# Altium project doppler.PrjPcb (part 1 of 2)
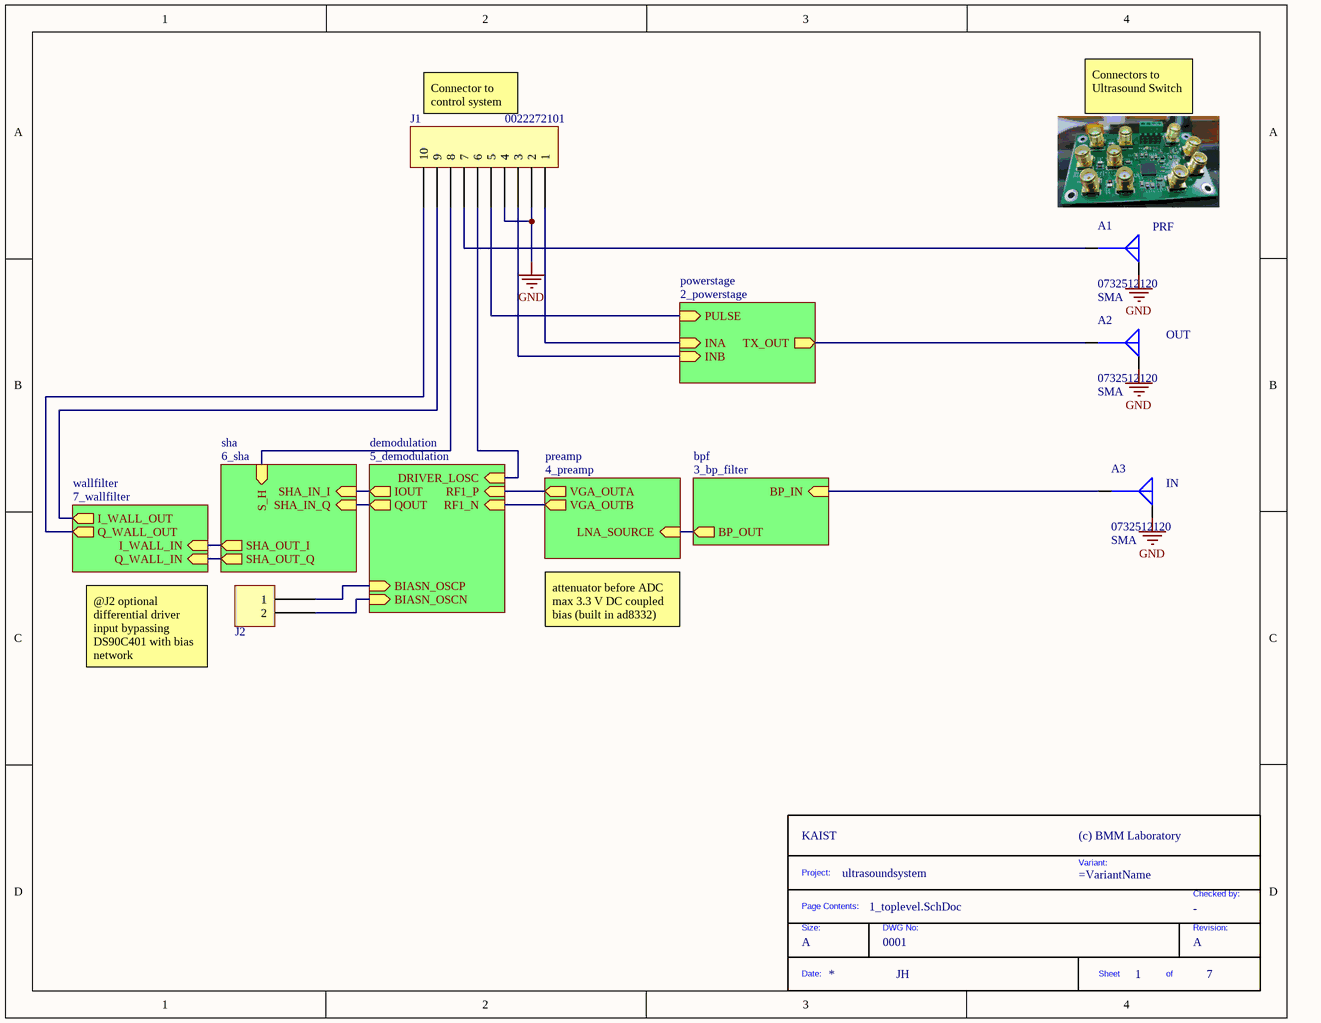
[diagram p0: 1_toplevel.SchDoc]
CAGE_CODE: ?????; COMPANY: KAIST; CONTRACT_NUMBER: <CONTRACT NO>; DesignedByURL: JH; DOC_NO_ASSY_DWG: <ASSY DWG NO>; DOC_NO_BOM: <BOM DOC NO>; DOC_NO_FAB_DWG: <FAB DWG NO>; DOC_NO_SCH_DWG: <SCH DWG NO>; MOTD: (c) BMM Laboratory; PCB_2_DEC_TOL: +/-.01; PCB_3_DEC_TOL: +/-.010; PCB_ANG_TOL: +/-1/2; PCB_ASSEMBLY_NO: <PCB ASSY NO>; PCB_CHECKER: - -----; PCB_CHECKER_APP_DATE: --/--/----; PCB_DESIGNER: JH; PCB_DESIGNER_APP_DATE: --/--/----; PCB_DWG_NO: <PCB DWG NO>; PCB_ENGINEER: JH; PCB_ENGINEER_APP_DATE: --/--/----; PCB_PART_NUMBER: <PCB PN>; PCB_REV: A; PROJECT: ultrasoundsystem; SCH_REV: A; VersionRevision: A
7 sheets, 117 parts. Net scope: hierarchical (ports join the sheet entries above them; power ports are global).
Board file: doppler.PcbDoc
Sheets:
  1_toplevel.SchDoc
    powerstage = 2_powerstage.SchDoc
    preamp = 4_preamp.SchDoc
    demodulation = 5_demodulation.SchDoc
    wallfilter = 7_wallfilter.SchDoc
    bpf = 3_bp_filter.SchDoc
    sha = 6_sha.SchDoc

## Sheet 1_toplevel.SchDoc
size A; SheetNumber: 1; SheetTotal: 7

### Parts
(Parts that share a designator on the sheet are numbered #1, #2 ... from top to bottom, then left to right.)
*?#1  DWG No: 0001  Size: A  (hidden comment: TitleBlock)  (graphical)
A1  0732512120  Connector Style: SMA  [MOLEX SD-73251-212]
A2  0732512120  Connector Style: SMA  [MOLEX SD-73251-212]
A3  0732512120  Connector Style: SMA  [MOLEX SD-73251-212]
J1  0022272101  [MOLEX KK 0022272101]
J2  0022272021  [MOLEX KK 0022272021]  (value not drawn)

### Sub-sheets
bpf = 3_bp_filter: BP_IN (in), BP_OUT (out)
demodulation = 5_demodulation: RF1_P (in), RF1_N (in), IOUT (out), QOUT (out), BIASN_OSCP (in), BIASN_OSCN (in), DRIVER_LOSC (in)
powerstage = 2_powerstage: INA (in), INB (in), TX_OUT (out), PULSE (in)
preamp = 4_preamp: LNA_SOURCE (in), VGA_OUTA (out), VGA_OUTB (out)
sha = 6_sha: SHA_IN_I (in), SHA_IN_Q (in), S_H (in), SHA_OUT_I (out), SHA_OUT_Q (out)
wallfilter = 7_wallfilter: I_WALL_IN (in), Q_WALL_IN (in), I_WALL_OUT (out), Q_WALL_OUT (out)

### Nets
GND: A1.G A2.G A3.G J1.2 J1.4
S_H: J1.8 ; sheet sha/S_H
NetA1_S: A1.S J1.7
NetA2_S: A2.S ; sheet powerstage/TX_OUT
NetA3_S: A3.S ; sheet bpf/BP_IN
NetC29_2: J2.1 ; sheet demodulation/BIASN_OSCP
NetC30_2: J2.2 ; sheet demodulation/BIASN_OSCN
NetC31_2: J1.6 ; sheet demodulation/DRIVER_LOSC
NetC35_1: sheet wallfilter/I_WALL_IN, sheet sha/SHA_OUT_I
NetC37_1: sheet wallfilter/Q_WALL_IN, sheet sha/SHA_OUT_Q
NetJ1_1: J1.1 ; sheet powerstage/INA
NetJ1_3: J1.3 ; sheet powerstage/INB
NetJ1_5: J1.5 ; sheet powerstage/PULSE
NetJ1_9: J1.9 ; sheet wallfilter/I_WALL_OUT
NetJ1_10: J1.10 ; sheet wallfilter/Q_WALL_OUT
NetR3_2: sheet preamp/VGA_OUTA, sheet demodulation/RF1_P
NetR4_2: sheet preamp/VGA_OUTB, sheet demodulation/RF1_N
NetU3_3: sheet preamp/LNA_SOURCE, sheet bpf/BP_OUT
NetU5_6: sheet demodulation/IOUT, sheet sha/SHA_IN_I
NetU6_6: sheet demodulation/QOUT, sheet sha/SHA_IN_Q

### Notes on the sheet
- Connector to control system
- Connectors to Ultrasound Switch
- (near A1) PRF
- (near A2) OUT
- (near A3) IN
- attenuator before ADC
  max 3.3 V DC coupled bias (built in ad8332)
- @J2 optional differential driver input bypassing DS90C401 with bias network
- (in symbol TitleBlock) Project:; Variant:; Checked by:; Page Contents:; Size:; DWG No:; Revision:; Date:; Sheet; of

### Library data of the parts
*?#1 = TitleBlock: Standard Title Block; Checked by: -
A1-A3 = 0732512120: CONN SMA JACK STR 50OHM EDGE MNT; Manufacturer: Molex; Connector Type: Jack, Female Socket; Contact Termination: Solder; Frequency - Max: 18GHz; Number of Ports: 1; Part Number: 0732512120; ComponentLink1Description: Datasheet; ComponentLink1URL: https://www.molex.com/pdm_docs/sd/732512120_sd.pdf; ComponentLink2Description: DigiKey Link; ComponentLink2URL: http://digikey.com/product-detail/en/molex/0732512120/WM5536-ND/1465158; Fastening Type: Threaded; Housing Color: Gold; Impedance: 50Ohm; LastUpdated: 2022-06-29 18:09:19; Lifecycle Status: Active; Minimum Order: 1; Mounting Feature: Bulkhead - Front Side Nut; Mounting Type: Board Edge, End Launch; Panel Mount; Packaging: Bag; Part Status: Active; Price: 3.64; Series: 73251; Shield Termination: Solder; Supplier 1: DigiKey; Supplier Part Number 1: WM5536-ND
J1 = 0022272101: CONN HEADER VERT 10POS 2.54MM; Manufacturer: Molex; Contact Length - Mating: 0.295" (7.49mm); Contact Length - Post: 0.140" (3.56mm); Material Flammability Rating: UL94 V-0; Number of Positions: 10; Number of Positions Loaded: All; Overall Contact Length: 0.560" (14.22mm); Pitch - Mating: 0.100" (2.54mm); Shrouding: Shrouded - 1 Wall; Style: Board to Cable/Wire; Part Number: 0022272101; ComponentLink1Description: Datasheet; ComponentLink1URL: https://www.molex.com/pdm_docs/sd/022272101_sd.pdf; ComponentLink2Description: DigiKey Link; ComponentLink2URL: http://digikey.com/product-detail/en/molex/0022272101/WM4119-ND/1130585; Connector Type: Header; Contact Finish - Mating: Tin; Contact Finish - Post: Tin; Contact Finish Thickness - Mating: 100.0µin (2.54µm); Contact Material: Brass; Contact Shape: Square; Contact Type: Male Pin; Fastening Type: Friction Lock; Insulation Color: Natural; Insulation Height: 0.461" (11.70mm); Insulation Material: Polyamide (PA), Nylon; LastUpdated: 2020-01-12 23:53:02; Lifecycle Status: Active; Minimum Order: 1; Mounting Type: Through Hole; Number of Rows: 1; Packaging: Bulk; PartId: 84; Part Status: Active; Price: 0.73; Series: KK 6410; Supplier 1: DigiKey; Supplier Part Number 1: WM4119-ND; Termination: Solder
J2 = 0022272021: CONN HEADER VERT 2POS 2.54MM; Manufacturer: Molex; Contact Length - Mating: 0.295" (7.49mm); Contact Length - Post: 0.140" (3.56mm); Material Flammability Rating: UL94 V-0; Number of Positions: 2; Number of Positions Loaded: All; Overall Contact Length: 0.560" (14.22mm); Pitch - Mating: 0.100" (2.54mm); Shrouding: Shrouded - 1 Wall; Style: Board to Cable/Wire; Part Number: 0022272021; ComponentLink1Description: Datasheet; ComponentLink1URL: https://www.molex.com/pdm_docs/sd/022272021_sd.pdf; ComponentLink2Description: DigiKey Link; ComponentLink2URL: http://digikey.com/product-detail/en/molex/0022272021/WM4111-ND/1130577; Connector Type: Header; Contact Finish - Mating: Tin; Contact Finish - Post: Tin; Contact Finish Thickness - Mating: 100.0µin (2.54µm); Contact Material: Brass; Contact Shape: Square; Contact Type: Male Pin; Fastening Type: Friction Lock; Insulation Color: Natural; Insulation Height: 0.461" (11.70mm); Insulation Material: Polyamide (PA), Nylon; LastUpdated: 2020-01-12 23:51:43; Lifecycle Status: Active; Minimum Order: 1; Mounting Type: Through Hole; Number of Rows: 1; Packaging: Bulk; PartId: 76; Part Status: Active; Price: 0.27; Series: KK 6410; Supplier 1: DigiKey; Supplier Part Number 1: WM4111-ND; Termination: Solder

## Sheet 2_powerstage.SchDoc
size A; SheetNumber: 2; SheetTotal: 7
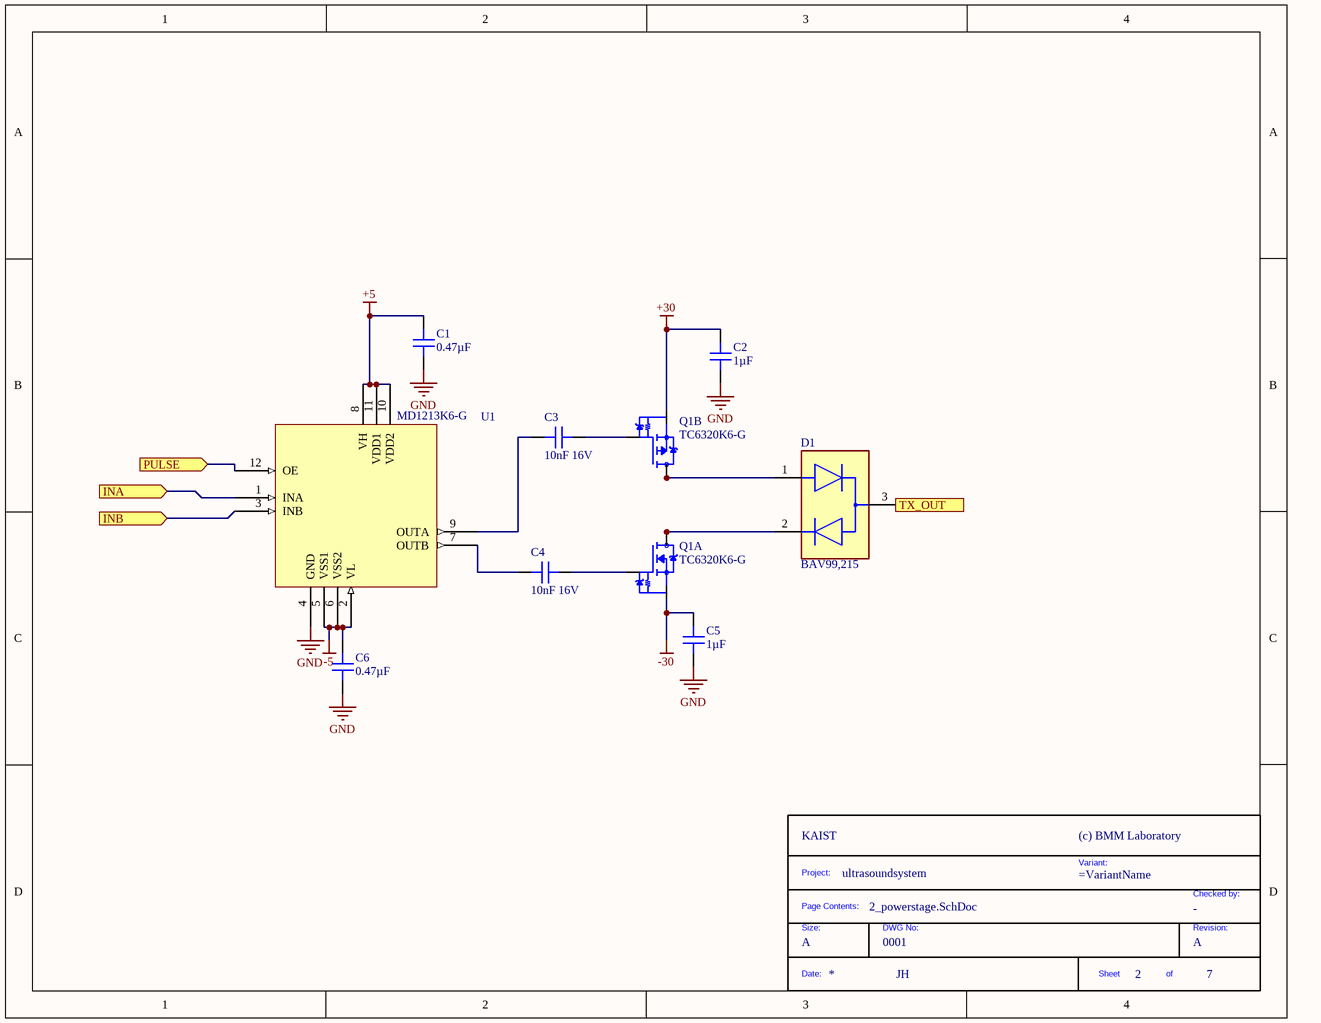
[diagram p1: 2_powerstage.SchDoc]

### Parts
(Parts that share a designator on the sheet are numbered #1, #2 ... from top to bottom, then left to right.)
*?#2  DWG No: 0001  Size: A  (hidden comment: TitleBlock)  (graphical)
C1  0.47µF  [CAP 1206_3216 - 1.8MM]
C2  1µF  [CAP 1206_3216 - 1.8MM]
C3  10nF 16V  [CAP 1206_3216 - 1.0MM]
C4  10nF 16V  [CAP 1206_3216 - 1.0MM]
C5  1µF  [CAP 1206_3216 - 1.8MM]
C6  0.47µF  [CAP 1206_3216 - 1.8MM]
D1  BAV99,215  [FP-SOT23-MFG]
Q1  TC6320K6-G  [SON100P400X400X100-10N]  (parts A,B of 2)
U1  MD1213K6-G  [QFN80P400X400X90-13N]

### Ports
INA (in), INB (in), PULSE (in), TX_OUT (out)

### Nets
+5: C1.2 U1.8(VH) U1.10(VDD2) U1.11(VDD1)
+30: C2.2 Q1.4(SP)
-5: C6.2 U1.2(VL) U1.5(VSS1) U1.6(VSS2)
-30: C5.2 Q1.1(SN)
GND: C1.1 C2.1 C5.1 C6.1 U1.4(GND)
NetA2_S: D1.3 ; port TX_OUT
NetC3_1: C3.1 U1.9(OUTA)
NetC3_2: C3.2 Q1.3(GP)
NetC4_1: C4.1 U1.7(OUTB)
NetC4_2: C4.2 Q1.2(GN)
NetD1_1: D1.1 Q1.5(DP) Q1.6(DP) Q1.10(DP)
NetD1_2: D1.2 Q1.7(DN) Q1.8(DN) Q1.9(DN)
NetJ1_1: U1.1(INA) ; port INA
NetJ1_3: U1.3(INB) ; port INB
NetJ1_5: U1.12(OE) ; port PULSE

### Notes on the sheet
- (in symbol TitleBlock) Project:; Variant:; Checked by:; Page Contents:; Size:; DWG No:; Revision:; Date:; Sheet; of

### Library data of the parts
*?#2 = TitleBlock: Standard Title Block; Checked by: -
C1 C6 = 12063C474KAT2A: CAP CER 0.47UF 25V X7R 1206; manufacturer: AVX Corporation; Tolerance: ±10%; Part Number: 12063C474KAT2A; Value: 0.47µF; Applications: General Purpose; Capacitance: 0.47µF; componentlink1description: Datasheet; componentlink1url: http://datasheets.avx.com/X7RDielectric.pdf; componentlink2description: DigiKey Link; componentlink2url: http://digikey.com/product-detail/en/avx-corporation/12063C474KAT2A/478-1563-1-ND/564595; Device Package: 1206 (3216 Metric); lastupdated: 2020-09-02 01:05:39; Lifecycle Status: Active; Minimum Order: 1; Mounting Type: Surface Mount, MLCC; Operating Temperature: -55°C ~ 125°C; Package / Case: 1206 (3216 Metric); packaging: TapeAndReel; partid: 20474; Part Status: Active; price: 0.08; series: -; Size / Dimension: 0.126" L x 0.063" W (3.20mm x 1.60mm); Supplier 1: DigiKey; Supplier Part Number 1: 478-1563-1-ND; Temperature Coefficient: X7R; Thickness (Max): 0.050" (1.27mm); Voltage - Rated: 25V
C2 C5 = 12063G105ZAT2A: CAP CER 1UF 25V Y5V 1206; manufacturer: AVX Corporation; Temperature Coefficient: Y5V (F); Tolerance: -20%, +80%; Part Number: 12063G105ZAT2A; Value: 1µF; Applications: General Purpose; Capacitance: 1µF; componentlink1description: Datasheet; componentlink1url: http://datasheets.avx.com/Y5V.pdf; componentlink2description: DigiKey Link; componentlink2url: http://digikey.com/product-detail/en/avx-corporation/12063G105ZAT2A/478-5906-1-ND/2177838; Device Package: 1206 (3216 Metric); lastupdated: 2020-09-02 01:05:35; Lifecycle Status: Active; Minimum Order: 1; Mounting Type: Surface Mount, MLCC; Operating Temperature: -30°C ~ 85°C; Package / Case: 1206 (3216 Metric); packaging: TapeAndReel; partid: 21454; Part Status: Active; price: 0.07; series: -; Size / Dimension: 0.126" L x 0.063" W (3.20mm x 1.60mm); Supplier 1: DigiKey; Supplier Part Number 1: 478-5906-1-ND; Thickness (Max): 0.050" (1.27mm); Voltage - Rated: 25V
C3 C4 = 12061C103KAT2A: CAP CER 10000PF 100V X7R 1206; manufacturer: AVX Corporation; Tolerance: ±10%; Part Number: 12061C103KAT2A; Value: 10nF 16V; Applications: General Purpose; Capacitance: 10000pF; componentlink1description: Datasheet; componentlink1url: http://datasheets.avx.com/X7RDielectric.pdf; componentlink2description: DigiKey Link; componentlink2url: http://digikey.com/product-detail/en/avx-corporation/12061C103KAT2A/478-1523-1-ND/564555; Device Package: 1206 (3216 Metric); lastupdated: 2020-09-02 01:05:00; Lifecycle Status: Active; Minimum Order: 1; Mounting Type: Surface Mount, MLCC; Operating Temperature: -55°C ~ 125°C; Package / Case: 1206 (3216 Metric); packaging: TapeAndReel; partid: 20306; Part Status: Active; price: 0.06; series: -; Size / Dimension: 0.126" L x 0.063" W (3.20mm x 1.60mm); Supplier 1: DigiKey; Supplier Part Number 1: 478-1523-1-ND; Temperature Coefficient: X7R; Thickness (Max): 0.037" (0.94mm); Voltage - Rated: 100V
D1 = CMP-14399-000006-1: DIODE ARRAY GP 100V 215MA SOT23
Q1 = TC6320K6-G: Mosfet Array N and P-Channel 200V Surface Mount 8-DFN (4x4); MF: {'manufacturer': u'Microchip Technology / Atmel'}; MP: TC6320K6-G; Package: None; Availability: Unavailable; Value: *; Price: None
U1 = CMP-024-00000-1: Driver 2A 2-OUT High and Low Side Inv 12-Pin QFN EP T/R; Frequency: 100kHz; Channel Type: Independent; Fall Time: 6ns; Case/Package: QFN

## Sheet 4_preamp.SchDoc
size A; SheetNumber: 3; SheetTotal: 7
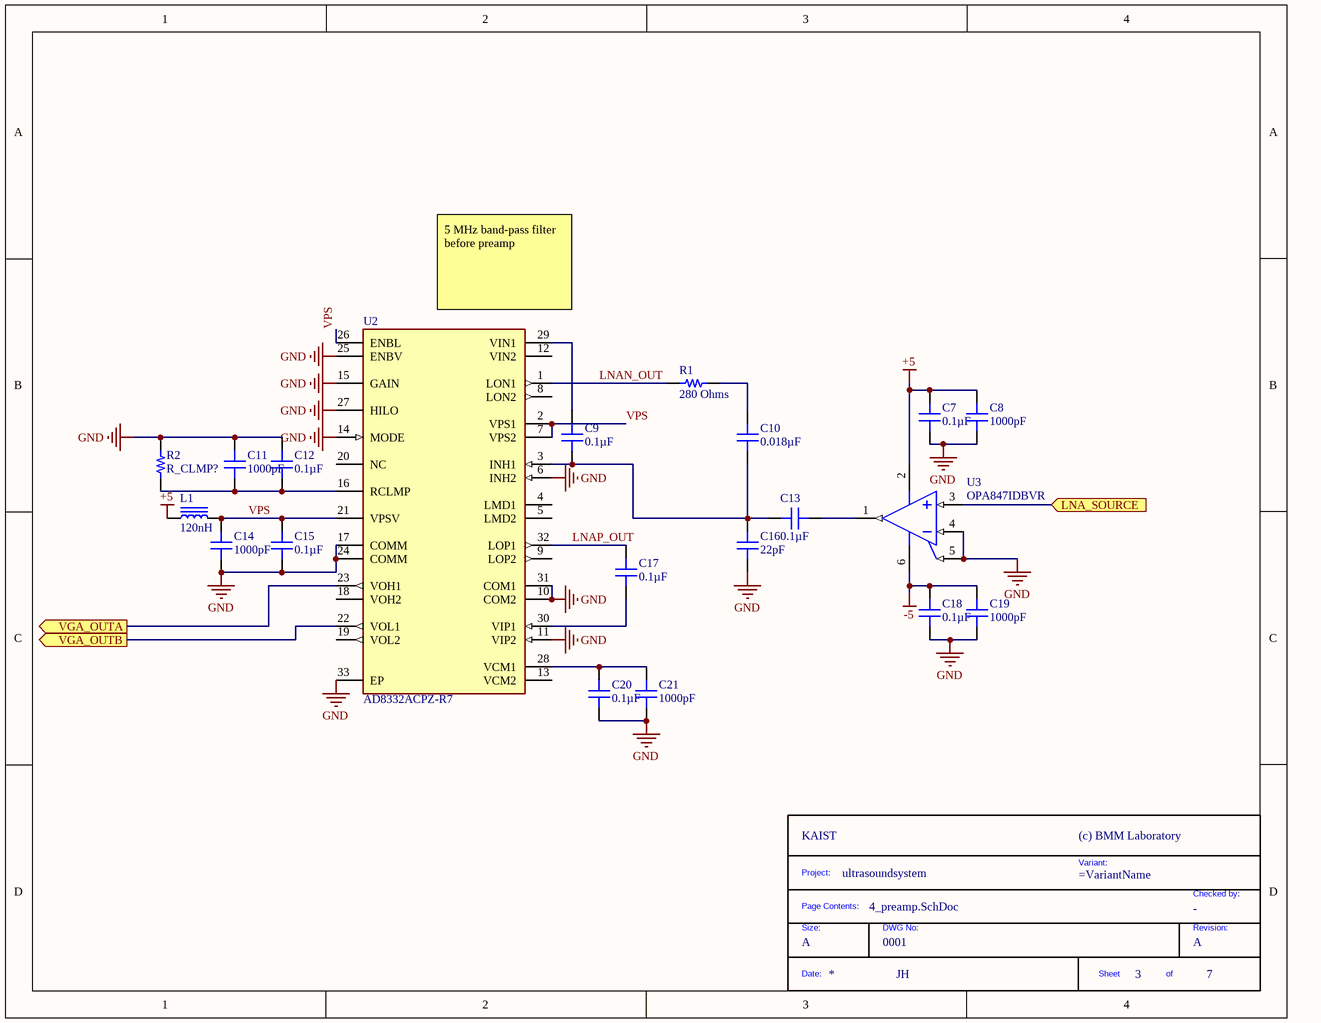
[diagram p2: 4_preamp.SchDoc]

### Parts
(Parts that share a designator on the sheet are numbered #1, #2 ... from top to bottom, then left to right.)
*?#3  DWG No: 0001  Size: A  (hidden comment: TitleBlock)  (graphical)
C7  0.1µF  [CAP 1206_3216 - 1.0MM]
C8  1000pF  [CAP 1206_3216 - 1.2MM]
C9  0.1µF  [CAP 1206_3216 - 1.0MM]
C10  0.018µF  [CAP 1206_3216 - 1.0MM]
C11  1000pF  [CAP 1206_3216 - 1.2MM]
C12  0.1µF  [CAP 1206_3216 - 1.0MM]
C13  0.1µF  [CAP 1206_3216 - 1.0MM]
C14  1000pF  [CAP 1206_3216 - 1.2MM]
C15  0.1µF  [CAP 1206_3216 - 1.0MM]
C16  22pF  [CAP 1206_3216 - 1.0MM]
C17  0.1µF  [CAP 1206_3216 - 1.0MM]
C18  0.1µF  [CAP 1206_3216 - 1.0MM]
C19  1000pF  [CAP 1206_3216 - 1.2MM]
C20  0.1µF  [CAP 1206_3216 - 1.0MM]
C21  1000pF  [CAP 1206_3216 - 1.2MM]
L1  120nH  [IND 0603_1608 RF WW]
R1  280 Ohms  [RES 1206_3216]
R2  R_CLMP?  [RES 1206_3216]
U2  AD8332ACPZ-R7  [FP-CP-32-7-IPC_A]
U3  OPA847IDBVR  [DBV0006A_L]

### Ports
LNA_SOURCE (in), VGA_OUTA (out), VGA_OUTB (out)

### Nets
+5: C7.2 C8.2 L1.1 U3.2(VS-)
-5: C18.2 C19.2 U3.6(VS+)
GND: C7.1 C8.1 C11.2 C12.2 C14.1 C15.1 C16.2 C18.1 C19.1 C20.1 C21.1 R2.2 U2.6(INH2) U2.10(COM2) U2.11(VIP2) U2.14(MODE) U2.15(GAIN) U2.17(COMM) U2.24(COMM) U2.25(ENBV) U2.27(HILO) U2.31(COM1) U2.33(EP) U3.4(IN-) U3.5(~{DIS})
LNAN_OUT: R1.2 U2.1(LON1)
LNAP_OUT: C17.1 U2.32(LOP1)
VPS: C14.2 C15.2 L1.2 U2.2(VPS1) U2.7(VPS2) U2.21(VPSV) U2.26(ENBL)
NetC9_1: C9.1 U2.29(VIN1)
NetC9_2: C9.2 C10.2 C13.1 C16.1 U2.3(INH1)
NetC10_1: C10.1 R1.1
NetC11_1: C11.1 C12.1 R2.1 U2.16(RCLMP)
NetC13_2: C13.2 U3.1(OUT)
NetC17_2: C17.2 U2.30(VIP1)
NetC20_2: C20.2 C21.2 U2.28(VCM1)
NetR3_2: U2.23(VOH1) ; port VGA_OUTA
NetR4_2: U2.22(VOL1) ; port VGA_OUTB
NetU3_3: U3.3(IN+) ; port LNA_SOURCE

Not connected (* = marked no-connect by the designer): U2 4(LMD1) 5(LMD2) 8(LON2) 9(LOP2) 12(VIN2) 13(VCM2) 18(VOH2) 19(VOL2) 20(NC)

### Notes on the sheet
- (near U2) 5 MHz band-pass filter before preamp
- (in symbol TitleBlock) Project:; Variant:; Checked by:; Page Contents:; Size:; DWG No:; Revision:; Date:; Sheet; of

### Library data of the parts
*?#3 = TitleBlock: Standard Title Block; Checked by: -
C7 C9 C12 C13 C15 C17 C18 C20 = 12065C104JAT2A: CAP CER 0.1UF 50V X7R 1206; manufacturer: AVX Corporation; Tolerance: ±5%; Part Number: 12065C104JAT2A; Value: 0.1µF; Applications: General Purpose; Capacitance: 0.1µF; componentlink1description: Datasheet; componentlink1url: http://datasheets.avx.com/X7RDielectric.pdf; componentlink2description: DigiKey Link; componentlink2url: http://digikey.com/product-detail/en/avx-corporation/12065C104JAT2A/478-3797-1-ND/1116495; Device Package: 1206 (3216 Metric); lastupdated: 2020-09-02 01:05:06; Lifecycle Status: Active; Minimum Order: 1; Mounting Type: Surface Mount, MLCC; Operating Temperature: -55°C ~ 125°C; Package / Case: 1206 (3216 Metric); packaging: TapeAndReel; partid: 19088; Part Status: Active; price: 0.06; series: -; Size / Dimension: 0.126" L x 0.063" W (3.20mm x 1.60mm); Supplier 1: DigiKey; Supplier Part Number 1: 478-3797-1-ND; Temperature Coefficient: X7R; Thickness (Max): 0.037" (0.94mm); Voltage - Rated: 50V
C8 C11 C14 C19 C21 = 12067C102KAT2A: CAP CER 1000PF 500V X7R 1206; manufacturer: AVX Corporation; Tolerance: ±10%; Part Number: 12067C102KAT2A; Value: 1000pF; Applications: General Purpose; Capacitance: 1000pF; componentlink1description: Datasheet; componentlink1url: http://datasheets.avx.com/X7RDielectric.pdf; componentlink2description: DigiKey Link; componentlink2url: http://digikey.com/product-detail/en/avx-corporation/12067C102KAT2A/478-3805-1-ND/1116503; Device Package: 1206 (3216 Metric); lastupdated: 2020-09-02 01:05:09; Lifecycle Status: Active; Minimum Order: 1; Mounting Type: Surface Mount, MLCC; Operating Temperature: -55°C ~ 125°C; Package / Case: 1206 (3216 Metric); packaging: TapeAndReel; partid: 19161; Part Status: Active; price: 0.09; series: -; Size / Dimension: 0.126" L x 0.063" W (3.20mm x 1.60mm); Supplier 1: DigiKey; Supplier Part Number 1: 478-3805-1-ND; Temperature Coefficient: X7R; Thickness (Max): 0.040" (1.02mm); Voltage - Rated: 500V
C10 = 12061C183KAT2A: CAP CER 0.018UF 100V X7R 1206; manufacturer: AVX Corporation; Tolerance: ±10%; Part Number: 12061C183KAT2A; Value: 0.018µF; Applications: General Purpose; Capacitance: 0.018µF; componentlink1description: Datasheet; componentlink1url: http://datasheets.avx.com/X7RDielectric.pdf; componentlink2description: DigiKey Link; componentlink2url: http://digikey.com/product-detail/en/avx-corporation/12061C183KAT2A/478-10859-1-ND/7536389; Device Package: 1206 (3216 Metric); lastupdated: 2020-09-02 01:05:02; Lifecycle Status: Active; Minimum Order: 1; Mounting Type: Surface Mount, MLCC; Operating Temperature: -55°C ~ 125°C; Package / Case: 1206 (3216 Metric); packaging: TapeAndReel; partid: 19920; Part Status: Active; price: 0.05; series: -; Size / Dimension: 0.126" L x 0.063" W (3.20mm x 1.60mm); Supplier 1: DigiKey; Supplier Part Number 1: 478-10859-1-ND; Temperature Coefficient: X7R; Thickness (Max): 0.037" (0.94mm); Voltage - Rated: 100V
C16 = 12065A220JAT2A: CAP CER 22PF 50V C0G/NP0 1206; manufacturer: AVX Corporation; Temperature Coefficient: C0G, NP0; Tolerance: ±5%; Part Number: 12065A220JAT2A; Value: 22pF; Applications: General Purpose; Capacitance: 22pF; componentlink1description: Datasheet; componentlink1url: http://datasheets.avx.com/C0GNP0-Dielectric.pdf; componentlink2description: DigiKey Link; componentlink2url: http://digikey.com/product-detail/en/avx-corporation/12065A220JAT2A/478-1472-1-ND/564504; Device Package: 1206 (3216 Metric); lastupdated: 2020-09-02 01:04:55; Lifecycle Status: Active; Minimum Order: 1; Mounting Type: Surface Mount, MLCC; Operating Temperature: -55°C ~ 125°C; Package / Case: 1206 (3216 Metric); packaging: TapeAndReel; partid: 21165; Part Status: Active; price: 0.07; series: -; Size / Dimension: 0.126" L x 0.063" W (3.20mm x 1.60mm); Supplier 1: DigiKey; Supplier Part Number 1: 478-1472-1-ND; Thickness (Max): 0.037" (0.94mm); Voltage - Rated: 50V
L1 = LQW18CAR12J00D: FIXED IND 120NH 1500MA 58MOHM; Manufacturer: Murata Electronics; Current Rating (Amps): 1.5A; DC Resistance (DCR): 58mOhm Max; Frequency - Self Resonant: 1.5GHz; Inductance Frequency - Test: 10MHz; Material - Core: Ferrite; Shielding: Unshielded; Tolerance: ±5%; Type: Wirewound; Part Number: LQW18CAR12J00D; ComponentLink1Description: Datasheet; ComponentLink1URL: https://search.murata.co.jp/Ceramy/image/img/P02/JELF243A-0159.pdf; ComponentLink2Description: DigiKey Link; ComponentLink2URL: http://digikey.com/product-detail/en/murata-electronics/LQW18CAR12J00D/490-18177-1-ND/9742079; Device Package: 0603 (1608 Metric); Height - Seated (Max): 0.037" (0.95mm); Inductance: 120nH; LastUpdated: 2020-09-06 11:05:19; Lifecycle Status: Active; Minimum Order: 1; Mounting Type: Surface Mount; Operating Temperature: -40°C ~ 85°C; Package / Case: 0603 (1608 Metric); Packaging: TapeAndReel; PartId: 1197; Part Status: Active; Price: 0.22; Series: LQW18; Size / Dimension: 0.063" L x 0.031" W (1.60mm x 0.80mm); Supplier 1: DigiKey; Supplier Part Number 1: 490-18177-1-ND; Supplier Device Package: 0603; Value: 120nH
R1 = ERJ-8ENF2800V: RES SMD 280 OHM 1% 1/4W 1206; Manufacturer: Panasonic Electronic Components; Power (Watts): 0.25W, 1/4W; Temperature Coefficient: ±100ppm/°C; Part Number: ERJ-8ENF2800V; ComponentLink1Description: Datasheet; ComponentLink1URL: https://industrial.panasonic.com/cdbs/www-data/pdf/RDA0000/AOA0000C304.pdf; ComponentLink2Description: DigiKey Link; ComponentLink2URL: https://www.digikey.com/en/products/detail/panasonic-electronic-components/ERJ-8ENF2800V/88757; Composition: Thick Film; Device Package: 1206 (3216 Metric); Features: Automotive AEC-Q200; Height - Seated (Max): 0.028" (0.70mm); LastUpdated: 2022-09-19 13:28:39; Lifecycle Status: Active; Minimum Order: 1; Number of Terminations: 2; Operating Temperature: -55°C ~ 155°C; Package / Case: 1206 (3216 Metric); Packaging: TapeAndReel; PartId: 43874; Part Status: Active; Price: 0.02; Ratings: AEC-Q200; Resistance: 280 Ohms; Series: ERJ-8EN; Size / Dimension: 0.126" L x 0.063" W (3.20mm x 1.60mm); Supplier 1: DigiKey; Supplier Part Number 1: P280FCT-ND; Supplier Device Package: 1206; Tolerance: ±1%; Value: 280 Ohms
R2 = RNCP1206FTD1K00: RES 1K OHM 1% 1/2W 1206; Manufacturer: Stackpole Electronics Inc; Power (Watts): 0.5W, 1/2W; Resistance: 1 kOhms; Temperature Coefficient: ±100ppm/°C; Value: 1 kOhms; Part Number: RNCP1206FTD1K00; ComponentLink1Description: Datasheet; ComponentLink1URL: https://www.seielect.com/catalog/sei-rncp.pdf; ComponentLink2Description: DigiKey Link; ComponentLink2URL: https://www.digikey.com/en/products/detail/stackpole-electronics-inc/RNCP1206FTD1K00/2240337; Composition: Thin Film; Device Package: 1206 (3216 Metric); Features: Anti-Sulfur; Height - Seated (Max): 0.025" (0.65mm); LastUpdated: 2022-09-19 13:29:57; Lifecycle Status: Active; Minimum Order: 1; Number of Terminations: 2; Operating Temperature: -55°C ~ 155°C; Package / Case: 1206 (3216 Metric); Packaging: TapeAndReel; PartId: 26970; Part Status: Active; Price: 0.01; Series: RNCP; Size / Dimension: 0.122" L x 0.059" W (3.10mm x 1.50mm); Supplier 1: DigiKey; Supplier Part Number 1: RNCP1206FTD1K00CT-ND; Supplier Device Package: 1206; Tolerance: ±1%
U2 = CMP-09116-000345-1: IC VGAIN AMP 32LFCSP; Operating Supply Current: 58mA; -3db Bandwidth: 120MHz; Voltage Gain: 19dB; Power Supply Rejection Ratio (PSRR): 68dB; Power Dissipation: 1.97W; Number of Channels: 2; Gain: 55dB; Noise Figure: 4.2dB; Slew Rate: 650V/µs; Bandwidth: 100MHz; Min Supply Voltage: 4.5V; Max Supply Voltage: 5.5V; Input Offset Voltage (Vos): 50mV; Operating Supply Voltage: 5V; Input Resistance: 6kR; Case/Package: LFCSP EP; Contact Plating: Tin; Mount: Surface Mount; Package Quantity: 1500; Lead Free: Contains Lead; RoHS Compliant: Yes; Packaging: Tape and Reel; Series: X-AMP®; Min Operating Temperature: -40°C; REACH SVHC: No SVHC; Length: 5mm; Gain Bandwidth Product: 120MHz; Number of Pins: 32; Height: 0.8mm; Max Operating Temperature: 85°C; Radiation Hardening: No; Number of Amplifiers: 2; Width: 5mm; Number of Elements: 2
U3 = CMP-0018-00482-2: Wideband, Ultra-Low Noise, Voltage Feedback Operational Amplifier with Shutdown, 10 to 12 V, -40 to 85 degC, 6-pin SOT23 (DBV6), Green (RoHS & no Sb/Br); Manufacturer: Texas Instruments; Vs(Min)(V): 10; Settling Time (0.1%)(Typ)(ns): 20; Number of Channels: 1; THD (Fc is 1 MHz)(Typ)(dB): -96; Iib(Max)(nA): 42000; @ MHz: 5; Iq per channel(Max)(mA): 18.9; 2nd Harmonic(dBc): 105; Io(Typ)(mA): 75; Vn at Flatband(Typ)(nV/rtHz): 0.85; 3rd Harmonic(dBc): 110; Vio(Max)(mV): 0.5; Slew Rate(Typ)(V/us): 950; Acl, min stable gain(V/V): 12; Sub Family: High Output Current Amplifier (>=50mA), High Speed Amplifier (>=50MHz), Low Offset Voltage Amplifier (<=500uV); BW @ Acl(MHz): 600; Mounting Technology: Surface Mount; ComponentLink2URL: http://www.ti.com/general/docs/lit/getliterature.tsp?genericPartNumber=OPA847&fileType=pdf; Eco-Plan: Green (RoHS & no Sb/Br); ComponentLink2Description: Datasheet; Code_JEDEC: MO-178; PackageVersion: 4073253-5/K, 03/2006; PackageDescription: 6-Pin Plastic Small Outline, Body 1.6 x 2.9 mm, Pitch 0.95 mm; DatasheetVersion: SBOS251E; PartNumber: OPA847IDBVR; ComponentLink1Description: Manufacturer URL; ComponentLink3Description: Package Specification; ComponentLink3URL: http://www.ti.com/litv/pdf/mpds026h; ComponentLink1URL: http://www.ti.com/; Vs(Max)(V): 12; PackageReference: DBV0006A

## Sheet 5_demodulation.SchDoc
size A; SheetNumber: 5; SheetTotal: 7
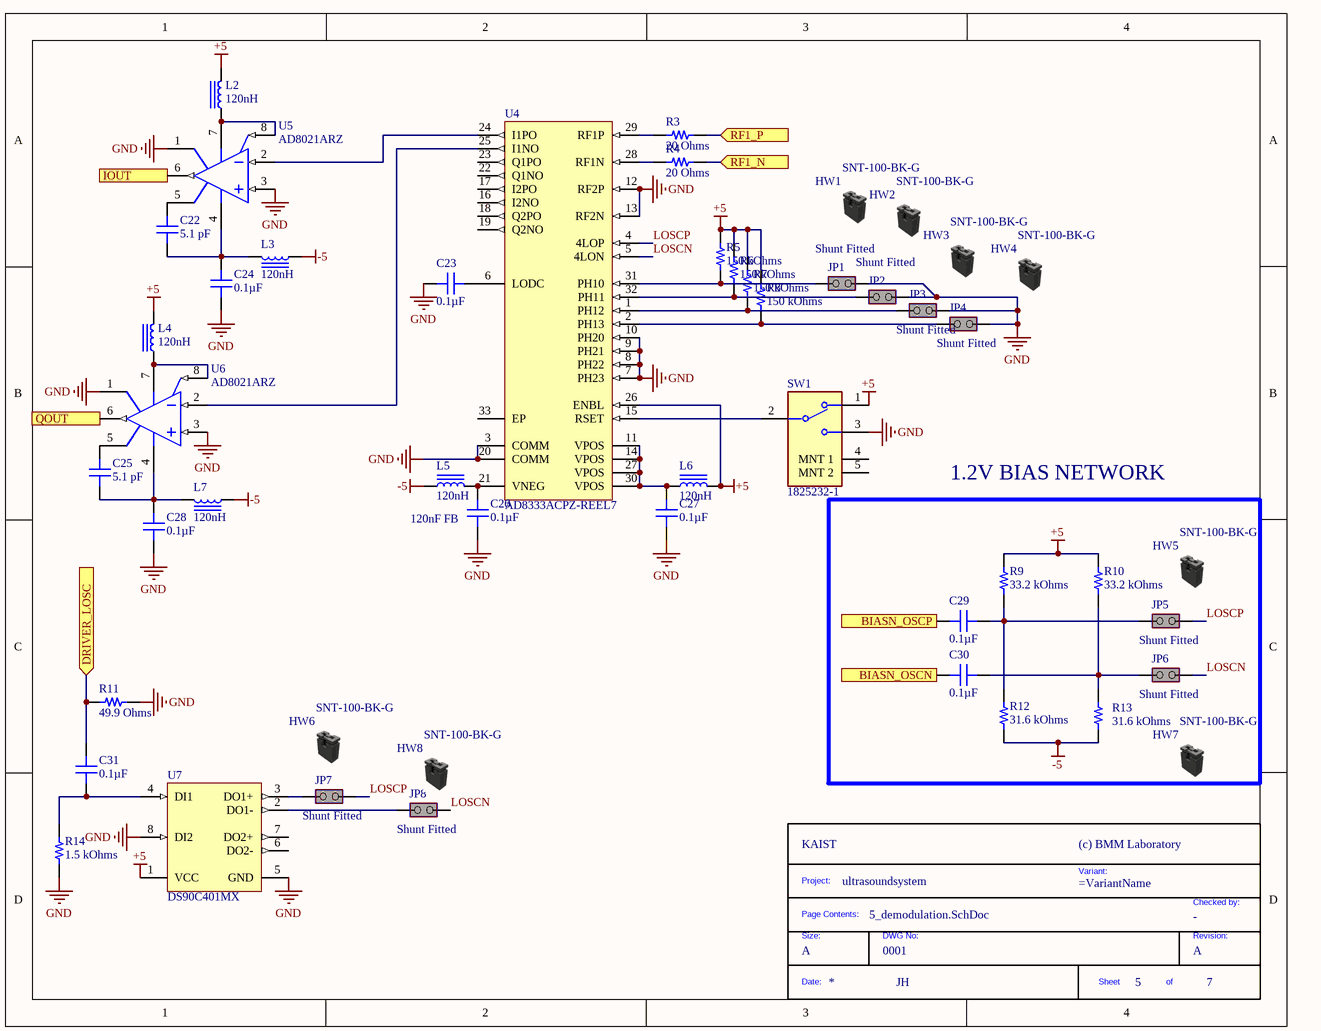
[diagram p3: 5_demodulation.SchDoc]

### Parts
(Parts that share a designator on the sheet are numbered #1, #2 ... from top to bottom, then left to right.)
*?#4  DWG No: 0001  Size: A  (hidden comment: TitleBlock)  (graphical)
C22  5.1 pF  [CAP 1206_3216 - 0.8MM]
C23  0.1µF  [CAP 1206_3216 - 1.0MM]
C24  0.1µF  [CAP 1206_3216 - 1.0MM]
C25  5.1 pF  [CAP 1206_3216 - 0.8MM]
C26  0.1µF  [CAP 1206_3216 - 1.0MM]
C27  0.1µF  [CAP 1206_3216 - 1.0MM]
C28  0.1µF  [CAP 1206_3216 - 1.0MM]
C29  0.1µF  [CAP 1206_3216 - 1.0MM]
C30  0.1µF  [CAP 1206_3216 - 1.0MM]
C31  0.1µF  [CAP 1206_3216 - 1.0MM]
HW1  value SNT-100-BK-G  (hidden comment: Shunt Black 2.54mm)  (mechanical)
HW2  value SNT-100-BK-G  (hidden comment: Shunt Black 2.54mm)  (mechanical)
HW3  value SNT-100-BK-G  (hidden comment: Shunt Black 2.54mm)  (mechanical)
HW4  value SNT-100-BK-G  (hidden comment: Shunt Black 2.54mm)  (mechanical)
HW5  value SNT-100-BK-G  (hidden comment: Shunt Black 2.54mm)  (mechanical)
HW6  value SNT-100-BK-G  (hidden comment: Shunt Black 2.54mm)  (mechanical)
HW7  value SNT-100-BK-G  (hidden comment: Shunt Black 2.54mm)  (mechanical)
HW8  value SNT-100-BK-G  (hidden comment: Shunt Black 2.54mm)  (mechanical)
JP1  value Shunt Fitted  [CON_SAMTEC_TSW-102-07-G-S]  (hidden comment: Jumper_Header 2x1 Fitted)
JP2  value Shunt Fitted  [CON_SAMTEC_TSW-102-07-G-S]  (hidden comment: Jumper_Header 2x1 Fitted)
JP3  value Shunt Fitted  [CON_SAMTEC_TSW-102-07-G-S]  (hidden comment: Jumper_Header 2x1 Fitted)
JP4  value Shunt Fitted  [CON_SAMTEC_TSW-102-07-G-S]  (hidden comment: Jumper_Header 2x1 Fitted)
JP5  value Shunt Fitted  [CON_SAMTEC_TSW-102-07-G-S]  (hidden comment: Jumper_Header 2x1 Fitted)
JP6  value Shunt Fitted  [CON_SAMTEC_TSW-102-07-G-S]  (hidden comment: Jumper_Header 2x1 Fitted)
JP7  value Shunt Fitted  [CON_SAMTEC_TSW-102-07-G-S]  (hidden comment: Jumper_Header 2x1 Fitted)
JP8  value Shunt Fitted  [CON_SAMTEC_TSW-102-07-G-S]  (hidden comment: Jumper_Header 2x1 Fitted)
L2  120nH  [IND 0603_1608 RF WW]
L3  120nH  [IND 0603_1608 RF WW]
L4  120nH  [IND 0603_1608 RF WW]
L5  120nH  [IND 0603_1608 RF WW]
L6  120nH  [IND 0603_1608 RF WW]
L7  120nH  [IND 0603_1608 RF WW]
R3  20 Ohms  [RES 1206_3216]
R4  20 Ohms  [RES 1206_3216]
R5  150 kOhms  [RES 1206_3216]
R6  150 kOhms  [RES 1206_3216]
R7  150 kOhms  [RES 1206_3216]
R8  150 kOhms  [RES 1206_3216]
R9  33.2 kOhms  [RES 1206_3216]
R10  33.2 kOhms  [RES 1206_3216]
R11  49.9 Ohms  [RES 1206_3216]
R12  31.6 kOhms  [RES 1206_3216]
R13  31.6 kOhms  [RES 1206_3216]
R14  1.5 kOhms  [RES 1206_3216]
SW1  1825232-1  [FP-1825232-1-MFG]
U4  AD8333ACPZ-REEL7  [ADI-CP-32-2_L]
U5  AD8021ARZ  [ADI-R-8_N]
U6  AD8021ARZ  [ADI-R-8_N]
U7  DS90C401MX  [D0008A_N]

### Blocks framed on the sheet
1.2V BIAS NETWORK: C29 C30 HW5 HW7 JP5 JP6 R9 R10 R12 R13

### Ports
BIASN_OSCN (in), BIASN_OSCP (in), DRIVER_LOSC (in), IOUT (out), QOUT (out), RF1_N (in), RF1_P (in)

### Nets
+5: L2.2 L4.2 L6.2 R5.2 R6.2 R7.2 R8.2 R9.2 R10.2 SW1.1 U4.26(ENBL) U7.1(VCC)
-5: L3.1 L5.1 L7.1 R12.2 R13.1
GND: C23.2 C24.2 C26.1 C27.1 C28.2 JP1.2(NO) JP2.2(NO) JP3.2(NO) JP4.2(NO) R11.2 R14.2 SW1.3 U4.3(COMM) U4.7(PH23) U4.8(PH22) U4.9(PH21) U4.10(PH20) U4.12(RF2P) U4.13(RF2N) U4.20(COMM) U5.1(LOGIC_REFERENCE) U5.3(+IN) U6.1(LOGIC_REFERENCE) U6.3(+IN) U7.5(GND) U7.8(DI2)
LOSCN: JP6.2(NO) JP8.2(NO) U4.5(4LON)
LOSCP: JP5.2(NO) JP7.2(NO) U4.4(4LOP)
NetC22_1: C22.1 C24.1 L3.2 U5.4(-VS)
NetC22_2: C22.2 U5.5(CCOMP)
NetC23_1: C23.1 U4.6(LODC)
NetC25_1: C25.1 C28.1 L7.2 U6.4(-VS)
NetC25_2: C25.2 U6.5(CCOMP)
NetC26_2: C26.2 L5.2 U4.21(VNEG)
NetC27_2: C27.2 L6.1 U4.11(VPOS) U4.14(VPOS) U4.27(VPOS) U4.30(VPOS)
NetC29_1: C29.1 JP5.1(COMMON) R9.1 R12.1
NetC29_2: C29.2 ; port BIASN_OSCP
NetC30_1: C30.1 JP6.1(COMMON) R10.1 R13.2
NetC30_2: C30.2 ; port BIASN_OSCN
NetC31_1: C31.1 R14.1 U7.4(DI1)
NetC31_2: C31.2 R11.1 ; port DRIVER_LOSC
NetJP1_1: JP1.1(COMMON) R5.1 U4.31(PH10)
NetJP2_1: JP2.1(COMMON) R6.1 U4.32(PH11)
NetJP3_1: JP3.1(COMMON) R7.1 U4.1(PH12)
NetJP4_1: JP4.1(COMMON) R8.1 U4.2(PH13)
NetJP7_1: JP7.1(COMMON) U7.3(DO1+)
NetJP8_1: JP8.1(COMMON) U7.2(DO1-)
NetL2_1: L2.1 U5.7(+VS) U5.8(~{DISABLE})
NetL4_1: L4.1 U6.7(+VS) U6.8(~{DISABLE})
NetR3_1: R3.1 U4.29(RF1P)
NetR3_2: R3.2 ; port RF1_P
NetR4_1: R4.1 U4.28(RF1N)
NetR4_2: R4.2 ; port RF1_N
NetSW1_2: SW1.2 U4.15(RSET)
NetU4_24: U4.24(I1PO) U5.2(-IN)
NetU4_25: U4.25(I1NO) U6.2(-IN)
NetU5_6: U5.6(VOUT) ; port IOUT
NetU6_6: U6.6(VOUT) ; port QOUT

Not connected (* = marked no-connect by the designer): SW1 4(MNT_1) 5(MNT_2); U4 16(I2NO) 17(I2PO) 18(Q2PO) 19(Q2NO) 22(Q1NO) 23(Q1PO) 33(EP); U7 6(DO2-) 7(DO2+)

### Notes on the sheet
- 120nF FB
- (in symbol TitleBlock) Project:; Variant:; Checked by:; Page Contents:; Size:; DWG No:; Revision:; Date:; Sheet; of

### Library data of the parts
*?#4 = TitleBlock: Standard Title Block; Checked by: -
C22 C25 = C1206C519C5GAC7800: CAP CER 5.1PF 50V C0G/NP0 1206; manufacturer: KEMET; Temperature Coefficient: C0G, NP0; Tolerance: ±0.25pF; Part Number: C1206C519C5GAC7800; Value: 5.1 pF; Applications: General Purpose; Capacitance: 5.1 pF; componentlink1description: Datasheet; componentlink1url: https://api.kemet.com/component-edge/download/datasheet/C1206C519C5GACTU.pdf; componentlink2description: DigiKey Link; componentlink2url: https://www.digikey.com/en/products/detail/kemet/C1206C519C5GAC7800/411185; Device Package: 1206 (3216 Metric); Features: Low ESL; lastupdated: 2023-04-30 19:15:17; Lifecycle Status: Active; Minimum Order: 1; Mounting Type: Surface Mount, MLCC; Operating Temperature: -55°C ~ 125°C; Package / Case: 1206 (3216 Metric); packaging: TapeAndReel; partid: 30067; Part Status: Active; price: 0.16; series: SMD Comm C0G; Size / Dimension: 0.126" L x 0.063" W (3.20mm x 1.60mm); Supplier 1: DigiKey; Supplier Part Number 1: 399-C1206C519C5GAC7800CT-ND; Thickness (Max): 0.035" (0.88mm); Voltage - Rated: 50V
C23 C24 C26-C31 = 12065C104JAT2A: as C7 on sheet 4_preamp; Part Number: 12065C104JAT2A; Value: 0.1µF; Applications: General Purpose; Capacitance: 0.1µF; componentlink1description: Datasheet; componentlink1url: http://datasheets.avx.com/X7RDielectric.pdf; componentlink2description: DigiKey Link; componentlink2url: http://digikey.com/product-detail/en/avx-corporation/12065C104JAT2A/478-3797-1-ND/1116495; Device Package: 1206 (3216 Metric); lastupdated: 2020-09-02 01:05:06; Lifecycle Status: Active; Minimum Order: 1; Mounting Type: Surface Mount, MLCC; Operating Temperature: -55°C ~ 125°C; Package / Case: 1206 (3216 Metric); packaging: TapeAndReel; partid: 19088; Part Status: Active; price: 0.06; series: -; Size / Dimension: 0.126" L x 0.063" W (3.20mm x 1.60mm); Supplier 1: DigiKey; Supplier Part Number 1: 478-3797-1-ND; Temperature Coefficient: X7R; Thickness (Max): 0.037" (0.94mm); Voltage - Rated: 50V
HW1-HW8 = MCD-00043: SHUNT 2.54mm BLACK; Manufacturer: SAMTEC; Part_Type: Mechanical; Alternate_Manufacturer_Part_Number: 316102S111A; Alternate_Manufacturer: JIUBABA; Provided_By: SUBCO; Internal_Part_Number: MCD-00043; Manufacturer_Part_Number: SNT-100-BK-G; ComponentLink1Description: Datasheet; Status: Released; ComponentLink1URL: http://tunmcdsvn.tun.st.com/Component_Datasheet_Library/Trunk/Connectors/Samtec_Shunt_Jumper_SNT100; ECCN_US: n/a; ECCN_EU: n/a
JP1-JP8 = MCD-00683: Header, 2x1, 2,54mm, VR, TH, Height 5.84mm/2.54mm - Shunt Fitted by default; Part_Type: Connector; Manufacturer_Part_Number: TSW-102-07-x-S; Manufacturer: SAMTEC; Alternate_Manufacturer_Part_Number: 313102S111116; Alternate_Manufacturer: LIANYI; Provided_By: SUBCO; Internal_Part_Number: MCD-00683; Status: Released; ComponentLink1Description: Datasheet; ComponentLink1URL: http://tunmcdsvn.tun.st.com/Component_Datasheet_Library/Trunk/Connectors/Samtec_TSW-HTSW-series; ECCN_US: n/a; ECCN_EU: n/a
L2-L4 L6 L7 = LQW18CAR12J00D: as L1 on sheet 4_preamp; Part Number: LQW18CAR12J00D; ComponentLink1Description: Datasheet; ComponentLink1URL: https://search.murata.co.jp/Ceramy/image/img/P02/JELF243A-0159.pdf; ComponentLink2Description: DigiKey Link; ComponentLink2URL: http://digikey.com/product-detail/en/murata-electronics/LQW18CAR12J00D/490-18177-1-ND/9742079; Device Package: 0603 (1608 Metric); Height - Seated (Max): 0.037" (0.95mm); Inductance: 120nH; LastUpdated: 2020-09-06 11:05:19; Lifecycle Status: Active; Minimum Order: 1; Mounting Type: Surface Mount; Operating Temperature: -40°C ~ 85°C; Package / Case: 0603 (1608 Metric); Packaging: TapeAndReel; PartId: 1197; Part Status: Active; Price: 0.22; Series: LQW18; Size / Dimension: 0.063" L x 0.031" W (1.60mm x 0.80mm); Supplier 1: DigiKey; Supplier Part Number 1: 490-18177-1-ND; Supplier Device Package: 0603; Value: 120nH
L5 = 744761212C: FIXED IND 120NH 300MA 650 MOHM; Manufacturer: Würth Elektronik; DC Resistance (DCR): 650mOhm Max; Frequency - Self Resonant: 1.3GHz; Inductance Frequency - Test: 150MHz; Material - Core: Ceramic; Q @ Freq: 30 @ 150MHz; Shielding: Unshielded; Tolerance: ±5%; Type: Wirewound; Part Number: 744761212C; ComponentLink1Description: Datasheet; ComponentLink1URL: https://katalog.we-online.de/pbs/datasheet/744761212C.pdf; ComponentLink2Description: DigiKey Link; ComponentLink2URL: http://digikey.com/product-detail/en/w-rth-elektronik/744761212C/732-1768-1-ND/1994348; Current Rating (Amps): 300mA; Device Package: 0603 (1608 Metric); Height - Seated (Max): 0.043" (1.10mm); Inductance: 120nH; LastUpdated: 2020-09-06 11:05:21; Lifecycle Status: Active; Minimum Order: 1; Mounting Type: Surface Mount; Operating Temperature: -40°C ~ 125°C; Package / Case: 0603 (1608 Metric); Packaging: TapeAndReel; PartId: 1481; Part Status: Active; Price: 0.23; Series: WE-KI; Size / Dimension: 0.065" L x 0.045" W (1.65mm x 1.15mm); Supplier 1: DigiKey; Supplier Part Number 1: 732-1768-1-ND; Supplier Device Package: 0603 (1608 Metric); Value: 120nH
R3 R4 = RNCP1206FTD20R0: RES 20 OHM 1% 1/2W 1206; Manufacturer: Stackpole Electronics Inc; Power (Watts): 0.5W, 1/2W; Temperature Coefficient: ±100ppm/°C; Part Number: RNCP1206FTD20R0; ComponentLink1Description: Datasheet; ComponentLink1URL: https://www.seielect.com/catalog/sei-rncp.pdf; ComponentLink2Description: DigiKey Link; ComponentLink2URL: https://www.digikey.com/en/products/detail/stackpole-electronics-inc/RNCP1206FTD20R0/2240306; Composition: Thin Film; Device Package: 1206 (3216 Metric); Features: Anti-Sulfur; Height - Seated (Max): 0.025" (0.65mm); LastUpdated: 2022-09-19 13:29:44; Lifecycle Status: Active; Minimum Order: 1; Number of Terminations: 2; Operating Temperature: -55°C ~ 155°C; Package / Case: 1206 (3216 Metric); Packaging: TapeAndReel; PartId: 29216; Part Status: Active; Price: 0.01; Resistance: 20 Ohms; Series: RNCP; Size / Dimension: 0.122" L x 0.059" W (3.10mm x 1.50mm); Supplier 1: DigiKey; Supplier Part Number 1: RNCP1206FTD20R0CT-ND; Supplier Device Package: 1206; Tolerance: ±1%; Value: 20 Ohms
R5-R8 = KTR18EZPF1503: RES SMD 150K OHM 1% 1/4W 1206; Manufacturer: Rohm Semiconductor; Power (Watts): 0.25W, 1/4W; Temperature Coefficient: ±100ppm/°C; Part Number: KTR18EZPF1503; ComponentLink1Description: Datasheet; ComponentLink1URL: https://www.rohm.com/datasheet/KTR03EZPF/ktr-e; ComponentLink2Description: DigiKey Link; ComponentLink2URL: https://www.digikey.com/en/products/detail/rohm-semiconductor/KTR18EZPF1503/1983702; Composition: Thick Film; Device Package: 1206 (3216 Metric); Features: Automotive AEC-Q200, High Voltage; Height - Seated (Max): 0.026" (0.65mm); LastUpdated: 2022-09-19 13:29:15; Lifecycle Status: Active; Minimum Order: 1; Number of Terminations: 2; Operating Temperature: -55°C ~ 155°C; Package / Case: 1206 (3216 Metric); Packaging: TapeAndReel; PartId: 35710; Part Status: Active; Price: 0.03; Ratings: AEC-Q200; Resistance: 150 kOhms; Series: KTR; Size / Dimension: 0.126" L x 0.063" W (3.20mm x 1.60mm); Supplier 1: DigiKey; Supplier Part Number 1: RHM150KAICT-ND; Supplier Device Package: 1206; Tolerance: ±1%; Value: 150 kOhms
R9 R10 = RK73H2BTTD3322F: RES 33.2K OHM 1% 1/4W 1206; Manufacturer: KOA Speer Electronics, Inc.; Power (Watts): 0.25W, 1/4W; Temperature Coefficient: ±100ppm/°C; Part Number: RK73H2BTTD3322F; ComponentLink1Description: Datasheet; ComponentLink1URL: http://www.koaspeer.com/catimages/Products/RK73H/RK73H.pdf; ComponentLink2Description: DigiKey Link; ComponentLink2URL: https://www.digikey.com/en/products/detail/koa-speer-electronics-inc/RK73H2BTTD3322F/10235905; Composition: Thick Film; Device Package: 1206 (3216 Metric); Features: Automotive AEC-Q200, Moisture Resistant; Height - Seated (Max): 0.028" (0.70mm); LastUpdated: 2022-09-19 13:29:27; Lifecycle Status: Active; Minimum Order: 1; Number of Terminations: 2; Operating Temperature: -55°C ~ 155°C; Package / Case: 1206 (3216 Metric); Packaging: CutTape; PartId: 33401; Part Status: Active; Price: 0.01; Ratings: AEC-Q200; Resistance: 33.2 kOhms; Series: RK73H; Size / Dimension: 0.126" L x 0.063" W (3.20mm x 1.60mm); Supplier 1: DigiKey; Supplier Part Number 1: 2019-RK73H2BTTD3322FCT-ND; Supplier Device Package: 1206; Tolerance: ±1%; Value: 33.2 kOhms
R11 = RT1206BRD0749R9L: RES SMD 49.9 OHM 0.1% 1/4W 1206; Manufacturer: Yageo; Power (Watts): 0.25W, 1/4W; Temperature Coefficient: ±25ppm/°C; Part Number: RT1206BRD0749R9L; ComponentLink1Description: Datasheet; ComponentLink1URL: https://www.yageo.com/upload/media/product/productsearch/datasheet/rchip/PYu-RT_1-to-0.01_RoHS_L_11.pdf; ComponentLink2Description: DigiKey Link; ComponentLink2URL: https://www.digikey.com/en/products/detail/yageo/RT1206BRD0749R9L/1079849; Composition: Thin Film; Device Package: 1206 (3216 Metric); Height - Seated (Max): 0.026" (0.65mm); LastUpdated: 2023-04-30 19:44:00; Lifecycle Status: Active; Minimum Order: 1; Number of Terminations: 2; Operating Temperature: -55°C ~ 155°C; Package / Case: 1206 (3216 Metric); Packaging: TapeAndReel; PartId: 26863; Part Status: Active; Price: 0.09; Resistance: 49.9 Ohms; Series: RT; Size / Dimension: 0.122" L x 0.063" W (3.10mm x 1.60mm); Supplier 1: DigiKey; Supplier Part Number 1: YAG5080CT-ND; Supplier Device Package: 1206; Tolerance: ±0.1%; Value: 49.9 Ohms
R12 R13 = RC1206FR-0731K6L: RES 31.6K OHM 1% 1/4W 1206; Manufacturer: Yageo; Power (Watts): 0.25W, 1/4W; Temperature Coefficient: ±100ppm/°C; Part Number: RC1206FR-0731K6L; ComponentLink1Description: Datasheet; ComponentLink1URL: https://www.yageo.com/upload/media/product/productsearch/datasheet/rchip/PYu-RC_Group_51_RoHS_L_10.pdf; ComponentLink2Description: DigiKey Link; ComponentLink2URL: https://www.digikey.com/en/products/detail/yageo/RC1206FR-0731K6L/728811; Composition: Thick Film; Device Package: 1206 (3216 Metric); Features: Moisture Resistant; Height - Seated (Max): 0.026" (0.65mm); LastUpdated: 2022-09-19 13:29:31; Lifecycle Status: Active; Minimum Order: 1; Number of Terminations: 2; Operating Temperature: -55°C ~ 155°C; Package / Case: 1206 (3216 Metric); Packaging: TapeAndReel; PartId: 32438; Part Status: Active; Price: 0.01; Resistance: 31.6 kOhms; Series: RC_L; Size / Dimension: 0.122" L x 0.063" W (3.10mm x 1.60mm); Supplier 1: DigiKey; Supplier Part Number 1: 311-31.6KFRCT-ND; Supplier Device Package: 1206; Tolerance: ±1%; Value: 31.6 kOhms
R14 = CRGP1206F1K5: RES 1.5K OHM 1% 1/2W 1206; Manufacturer: TE Connectivity Passive Product; Power (Watts): 0.5W, 1/2W; Temperature Coefficient: ±100ppm/°C; Part Number: CRGP1206F1K5; ComponentLink1Description: Datasheet; ComponentLink1URL: https://www.te.com/commerce/DocumentDelivery/DDEController?Action=srchrtrv&DocNm=9-1773463-9&DocType=DS&DocLang=English; ComponentLink2Description: DigiKey Link; ComponentLink2URL: https://www.digikey.com/en/products/detail/te-connectivity-passive-product/CRGP1206F1K5/8577142; Composition: Thick Film; Device Package: 1206 (3216 Metric); Features: Pulse Withstanding; Height - Seated (Max): 0.026" (0.65mm); LastUpdated: 2023-04-30 19:43:51; Lifecycle Status: Active; Minimum Order: 1; Number of Terminations: 2; Operating Temperature: -55°C ~ 155°C; Package / Case: 1206 (3216 Metric); Packaging: TapeAndReel; PartId: 27822; Part Status: Active; Price: 0.03; Resistance: 1.5 kOhms; Series: CRGP; Size / Dimension: 0.122" L x 0.061" W (3.10mm x 1.55mm); Supplier 1: DigiKey; Supplier Part Number 1: A130540CT-ND; Supplier Device Package: 1206; Tolerance: ±1%; Value: 1.5 kOhms
SW1 = CMP-03405-000001-1: SWITCH SLIDE SPDT 200MA 30V; Manufacturer: TE Connectivity; Contact Current Rating: 0.2A; Contact Resistance: 20mΩ; Electromechanical Life: 10000Cycles; Operating Force: 200gf; Throw Configuration: SPDT; Manufacturer Part Number: 1825232-1; Temperature Range High: +70°C; Height: 3.7mm; ComponentLink2URL: https://www.te.com/commerce/DocumentDelivery/DDEController?Action=showdoc&DocId=Customer+Drawing%7F1825232%7FB2%7Fpdf%7FEnglish%7FENG_CD_1825232_B2.pdf%7F1825232-1; Mount: Through Hole; Mouser Description: Slide Switches SLIDE SWITCH SPDT Right Angle; Package: 1825232-1; Temperature: -20°C to +70°C; Automotive: No; ComponentLink2Description: Datasheet; Lead Free: Yes; Octopart: https://octopart.com/1825232-1-te+connectivity-45209882; Device Class L1: Electromechanical; Digikey Description: SWITCH SLIDE SPDT 200MA 30V; Device Class L3: Slide Switches; Device Class L2: Switches; Voltage Rating Dc: 30V; Temperature Range Low: -20°C; Category: Switch; RoHS: TRUE
U4 = CMP-0285-00056-1: DC to 50 MHz, Dual I/Q Demodulator and Phase Shifter, CP-32-2, Pb-Free, 1500 Reel; Min RF Frequency (MHz): 0Hz; Amplitude Error (dB): 50mdB; IIP3 (+dBm): 30dBm; Phase Error (deg): 0.1Deg; Max RF Frequency (MHz): 50MHz; DatasheetVersion: Rev. D; ComponentLink1URL: www.analog.com; ComponentLink2Description: Datasheet; Code_JEDEC: MO-220-VHHD-2; ComponentLink3Description: Package Specification; PackageDescription: 32-Lead Lead Frame Chip Scale Package [LFCSP_VQ]; ComponentLink3URL: http://www.analog.com/static/imported-files/packages/414143737956480539664569CP_32_2.pdf; PackageReference: CP-32-2; ComponentLink1Description: Manufacturer URL; PackageVersion: Jan-2005; ComponentLink2URL: http://www.analog.com/static/imported-files/data_sheets/AD8333.pdf
U5 U6 = CMP-0384-00646-2: Single Channel Low Power Operational Amplifier, 490 MHz BW, 120 V/us SR, Industrial, 8-pin SOIC (R-8), Tube; Manufacturer: Analog Devices; Generic Part Number: AD8021; Small Signal Bandwidth: 490MHz; Iq/Amp: 7.7mA; V Span Max: 24V; V Span Min: 4.5V; Amplifiers Per Package: 1; Input Offset Voltage: 400uV; Input Bias Current: 7.5uA; Code_JEDEC: MS-012-AA; ComponentLink3Description: Package Specification; PackageDescription: 8-Pin Standard Small Outline Package, Body 3.9 x 4.9 mm, Pitch 1.27 mm; ComponentLink1URL: http://www.analog.com/en/index.html; PackageVersion: 060506-A; ComponentLink4Description: Reference Circuit; Mounting Technology: Surface Mount; ComponentLink4URL: http://www.analog.com/en/all-operational-amplifiers-op-amps/operational-amplifiers-op-amps/ad8021/products/product.html#product-recommendations; RevisionNote: Reference Circuit URL fixed; DatasheetVersion: Rev. F; ComponentLink2URL: http://www.analog.com/static/imported-files/data_sheets/AD8021.pdf; PackageReference: R-8; ComponentLink1Description: Manufacturer URL; ComponentLink3URL: http://www.analog.com/static/imported-files/packages/PKG_PDF/SOIC_Narrow%20(R)/R_8.pdf; ComponentLink2Description: Datasheet; Slew Rate: 120V/us; PartNumber: AD8021ARZ
U7 = CMP-0058-00917-3: Dual Low Voltage Differential Signaling (LVDS) Driver, 8 pin SOIC NARROW; Manufacturer: Texas Instruments; CompType: Interface IC; PackageTopMarking: NSZXTT*DS90C*401M; PowerWise: N; Code_JEDEC: MS-012-AA; PinCount: 8; RoHS: N; PackageDescription: SOIC Narrow, 4.9 x 3.9 x 1.45mm, 8 Lead, 1.27mm Pitch; Code_IPC: SOIC127P600-8; ComponentLink1Description: Datasheet URL; ComponentLink1URL: http://www.ti.com/general/docs/lit/getliterature.tsp?genericPartNumber=DS90C401&fileType=pdf; PackageReference: D0008A